# Altium project eeg-measurement-circuit_test-board.PrjPcb
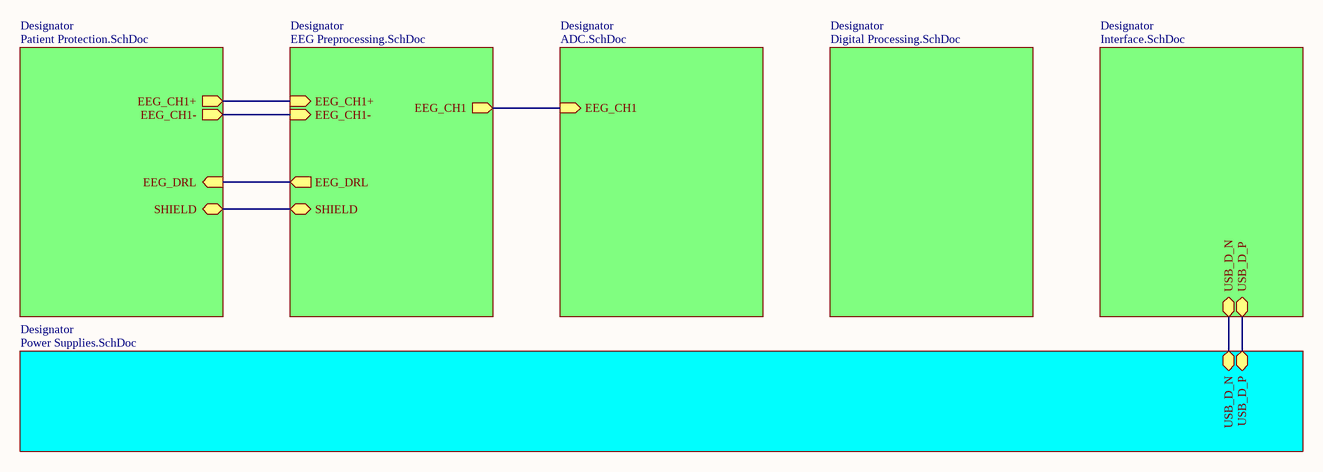
[diagram p0: Block Diagram.SchDoc]
6 sheets, 124 parts. Net scope: hierarchical (ports join the sheet entries above them; power ports are global).
Board file: PCB1.PcbDoc
Sheets:
  Block Diagram.SchDoc
    Designator = Power Supplies.SchDoc
    Designator = EEG Preprocessing.SchDoc
    Designator = ADC.SchDoc
    Designator = Interface.SchDoc
    Designator = Patient Protection.SchDoc

## Sheet Block Diagram.SchDoc: EEG Measurement Circuit
size A3; Date: 24/01/2025; DrawnBy: Giang Phan Truong; Revision: 1.1.0; SheetNumber: 1; SheetTotal: 7

### Sub-sheets
Designator = Power Supplies.SchDoc: USB_D_N (bidir), USB_D_P (bidir)
Designator = EEG Preprocessing.SchDoc: EEG_CH1+ (in), EEG_CH1- (in), EEG_CH1 (out), EEG_DRL (out), SHIELD (bidir)
Designator = ADC.SchDoc: EEG_CH1 (in)
Designator = Digital Processing.SchDoc (file not in this document): no entries
Designator = Interface.SchDoc: USB_D_P (bidir), USB_D_N (bidir)
Designator = Patient Protection.SchDoc: EEG_CH1+ (out), EEG_CH1- (out), EEG_DRL (in), SHIELD (bidir)

### Nets
SHIELD: sheet Designator/SHIELD, sheet Designator/SHIELD
USB_D_N: sheet Designator/USB_D_N, sheet Designator/USB_D_N
USB_D_P: sheet Designator/USB_D_P, sheet Designator/USB_D_P
NetC320_1: sheet Designator/EEG_DRL, sheet Designator/EEG_DRL
NetR200_2: sheet Designator/EEG_CH1-, sheet Designator/EEG_CH1-
NetR201_2: sheet Designator/EEG_CH1+, sheet Designator/EEG_CH1+
NetR322_1: sheet Designator/EEG_CH1, sheet Designator/EEG_CH1

### Notes on the sheet
- Project Name:
- Size
- Size:
- A3
- Revision:
- Drawn By:
- Date:
- File:
- Last Modified:
- Checked By:
- Sheet
- of

## Sheet Power Supplies.SchDoc: EEG Measurement Circuit
size A3; Date: 24/01/2025; DrawnBy: Giang Phan Truong; SheetNumber: 2; SheetTotal: 7
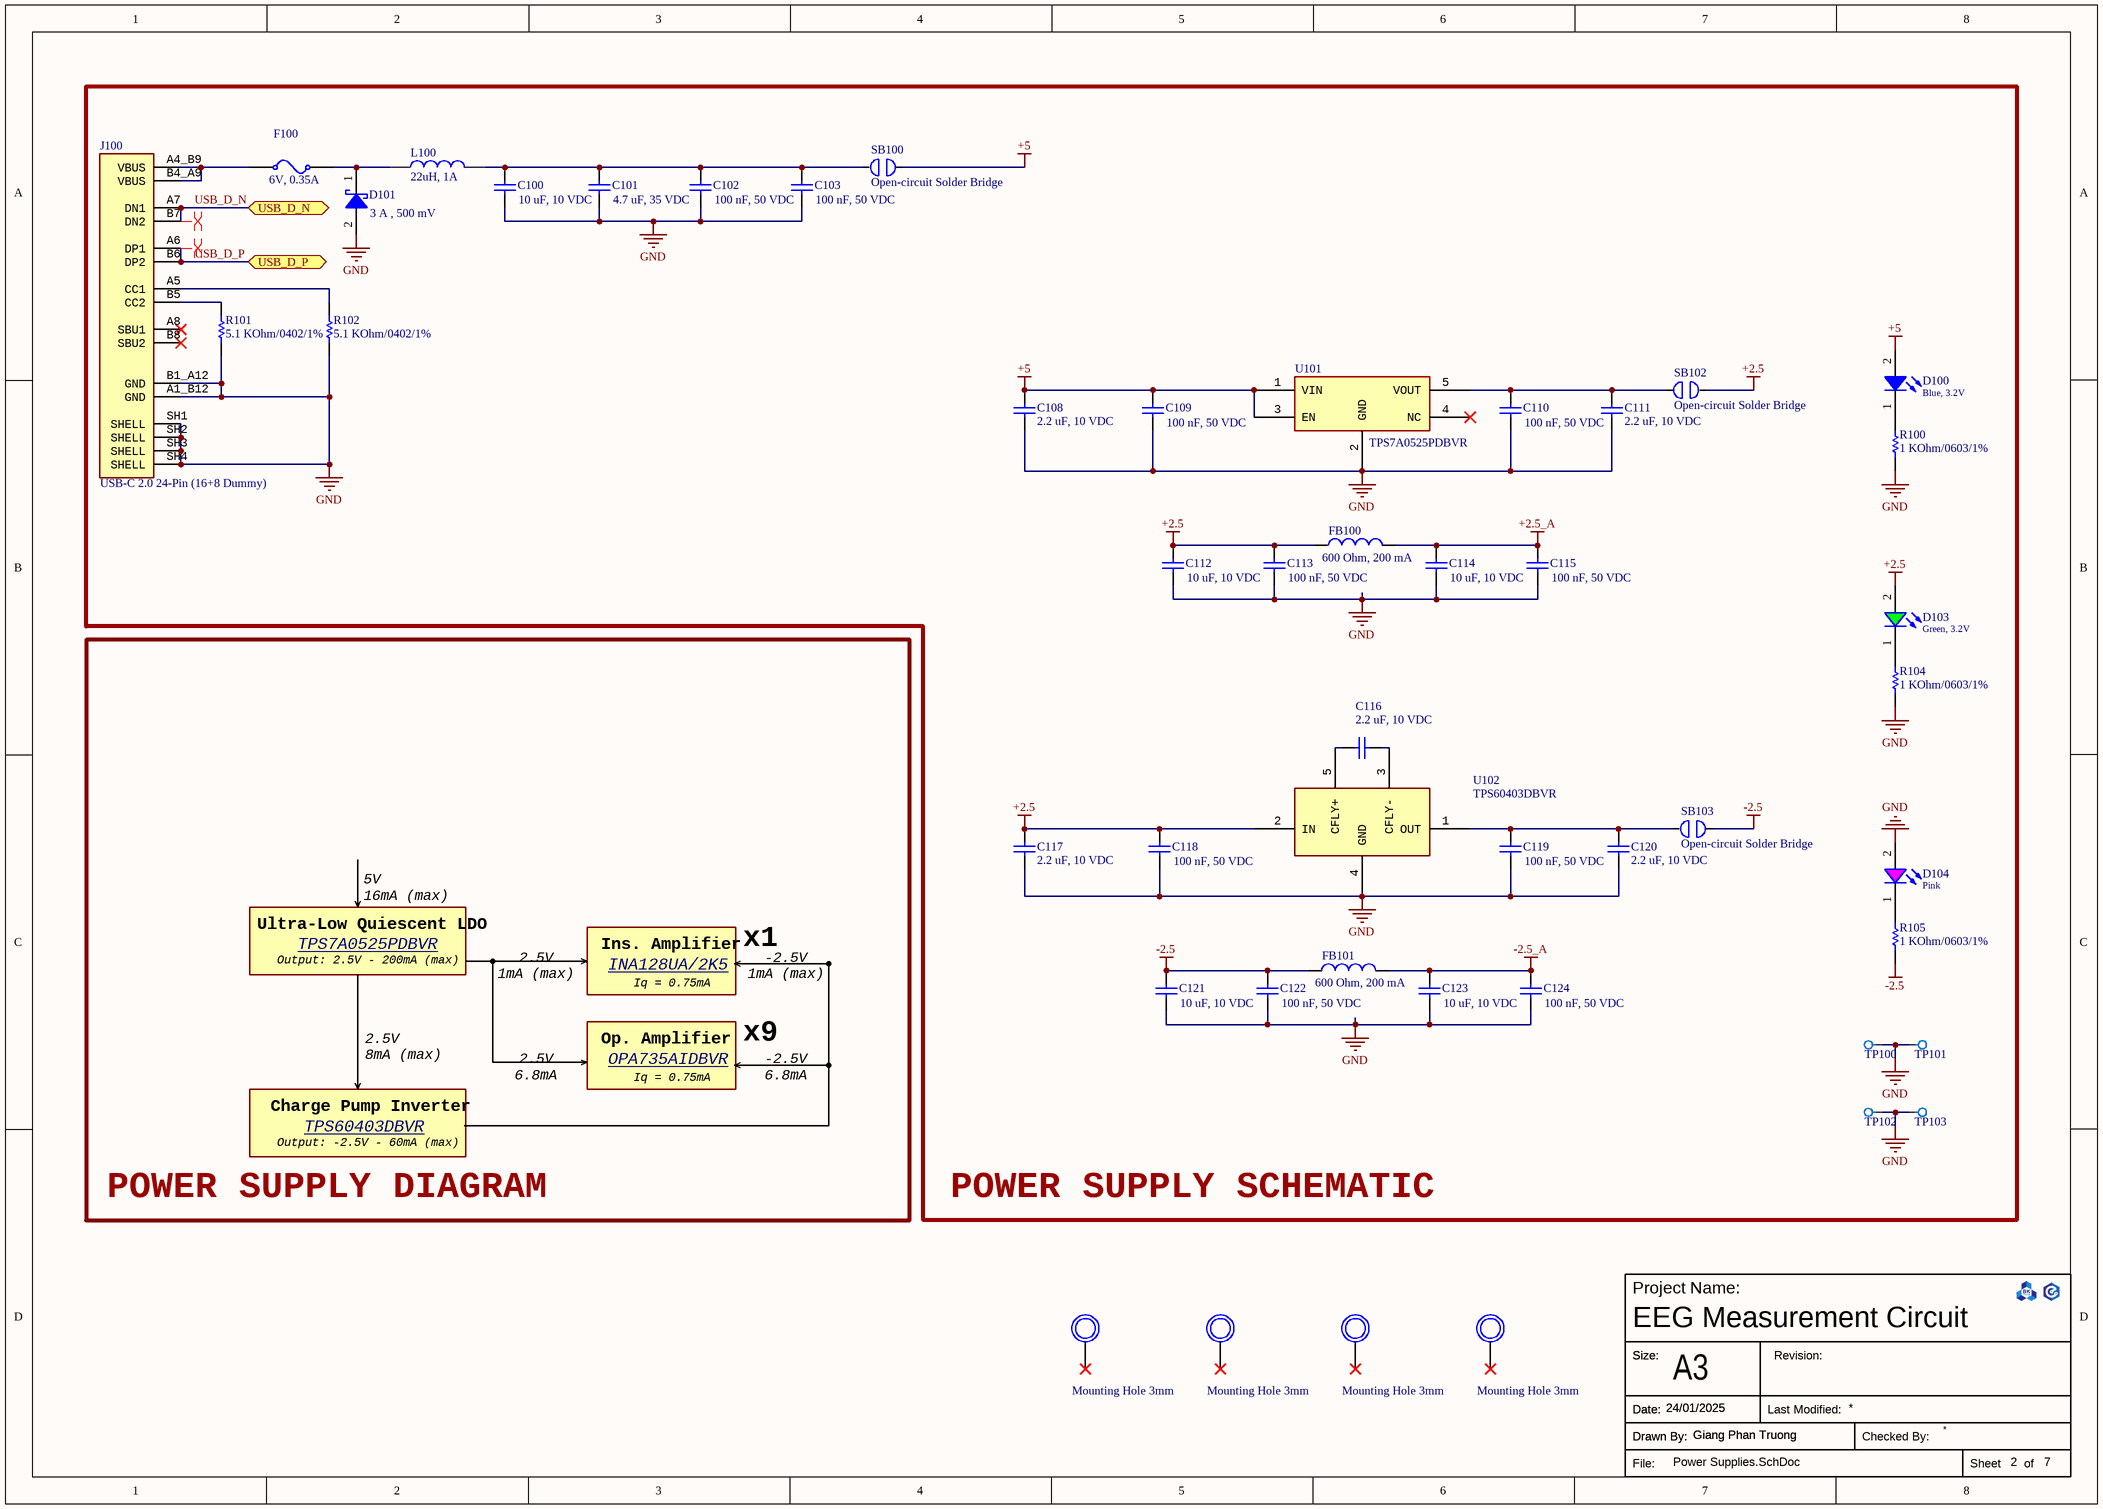
[diagram p1: Power Supplies.SchDoc]

### Parts
C100  10 uF, 10 VDC  [CAP_0603]
C101  4.7 uF, 35 VDC  [CAP_0603]
C102  100 nF, 50 VDC  [CAP_0603]
C103  100 nF, 50 VDC  [CAP_0603]
C108  2.2 uF, 10 VDC  [CAP_0603]
C109  100 nF, 50 VDC  [CAP_0603]
C110  100 nF, 50 VDC  [CAP_0603]
C111  2.2 uF, 10 VDC  [CAP_0603]
C112  10 uF, 10 VDC  [CAP_0603]
C113  100 nF, 50 VDC  [CAP_0603]
C114  10 uF, 10 VDC  [CAP_0603]
C115  100 nF, 50 VDC  [CAP_0603]
C116  2.2 uF, 10 VDC  [CAP_0603]
C117  2.2 uF, 10 VDC  [CAP_0603]
C118  100 nF, 50 VDC  [CAP_0603]
C119  100 nF, 50 VDC  [CAP_0603]
C120  2.2 uF, 10 VDC  [CAP_0603]
C121  10 uF, 10 VDC  [CAP_0603]
C122  100 nF, 50 VDC  [CAP_0603]
C123  10 uF, 10 VDC  [CAP_0603]
C124  100 nF, 50 VDC  [CAP_0603]
D100  Blue, 3.2V  [WL-SMCW_0603_H=0.7mm]
D101  3 A , 500 mV  [SMC (DO-214AB)]
D103  Green, 3.2V  [WL-SMCW_0603_H=0.7mm]
D104  Pink  [WL-SMCW_0603_H=0.7mm]
F100  6V, 0.35A  [Fuse_SMD_1206]
FB100  600 Ohm, 200 mA  [FER_0603]
FB101  600 Ohm, 200 mA  [FER_0603]
H100  Mounting Hole 3mm  [3mm with via]
H101  Mounting Hole 3mm  [3mm with via]
H102  Mounting Hole 3mm  [3mm with via]
H103  Mounting Hole 3mm  [3mm with via]
J100  value USB-C 2.0 24-Pin (16+8 Dummy)  [GCT_USB4105-GF-A]  (hidden comment: USB4105-GF-A)
L100  22uH, 1A  [Inductor_CDRH4D28]
R100  value 1 KOhm/0603/1%  [R0603]  (hidden comment: Resistor 1 KOhm 0603 1%)
R101  value 5.1 KOhm/0402/1%  [R0402]  (hidden comment: Resistor 5.1 KOhm 0402)
R102  value 5.1 KOhm/0402/1%  [R0402]  (hidden comment: Resistor 5.1 KOhm 0402)
R104  value 1 KOhm/0603/1%  [R0603]  (hidden comment: Resistor 1 KOhm 0603 1%)
R105  value 1 KOhm/0603/1%  [R0603]  (hidden comment: Resistor 1 KOhm 0603 1%)
SB100  Open-circuit Solder Bridge  [SolderBridgeOpen]
SB102  Open-circuit Solder Bridge  [SolderBridgeOpen]
SB103  Open-circuit Solder Bridge  [SolderBridgeOpen]
TP100  Testpoint_SMD  [TestPoint_Pad_3.0x3.0mm]  (value not drawn)
TP101  Testpoint_SMD  [TestPoint_Pad_3.0x3.0mm]  (value not drawn)
TP102  Testpoint_SMD  [TestPoint_Pad_3.0x3.0mm]  (value not drawn)
TP103  Testpoint_SMD  [TestPoint_Pad_3.0x3.0mm]  (value not drawn)
U101  TPS7A0525PDBVR  [DBV0005A_L]
U102  TPS60403DBVR  [SOT95P280X145-5N]

### Blocks framed on the sheet
POWER SUPPLY SCHEMATIC: C100-C103 C108-C124 D100 D101 D103 D104 F100 FB100 FB101 J100 L100 R100-R102 R104 R105 SB100 SB102 SB103 TP100-TP103 U101 U102

### Ports
USB_D_N (bidir, see Block Diagram[7B], Interface[5B]), USB_D_P (bidir, see Block Diagram[7B], Interface[5B])

### Nets
+2.5: C112.2 C113.2 C117.2 C118.2 D103.2(A) FB100.1 SB102.1 U102.2(IN)
+2.5_A: C114.2 C115.2 FB100.2
+5: C108.2 C109.2 D100.2(A) SB100.1 U101.1(VIN) U101.3(EN)
-2.5: C121.2 C122.2 FB101.1 R105.2 SB103.1
-2.5_A: C123.2 C124.2 FB101.2
GND: C100.1 C101.1 C102.1 C103.1 C108.1 C109.1 C110.1 C111.1 C112.1 C113.1 C114.1 C115.1 C117.1 C118.1 C119.1 C120.1 C121.1 C122.1 C123.1 C124.1 D101.2(A) D104.2(A) J100.A1_B12(GND) J100.B1_A12(GND) J100.SH1(SHELL) J100.SH2(SHELL) J100.SH3(SHELL) J100.SH4(SHELL) R100.2 R101.1 R102.1 R104.2 TP100.1 TP101.1 TP102.1 TP103.1 U101.2(GND) U102.4(GND)
USB_D_N: J100.A7(DN1) J100.B7(DN2) ; port USB_D_N
USB_D_P: J100.A6(DP1) J100.B6(DP2) ; port USB_D_P
NetC100_2: C100.2 C101.2 C102.2 C103.2 L100.2 SB100.2
NetC110_2: C110.2 C111.2 SB102.2 U101.5(VOUT)
NetC116_1: C116.1 U102.3(CFLY-)
NetC116_2: C116.2 U102.5(CFLY+)
NetC119_2: C119.2 C120.2 SB103.2 U102.1(OUT)
NetD100_1: D100.1(K) R100.1
NetD101_1: D101.1(K) F100.1 L100.1
NetD103_1: D103.1(K) R104.1
NetD104_1: D104.1(K) R105.1
NetF100_0: F100.0 J100.A4_B9(VBUS) J100.B4_A9(VBUS)
NetJ100_A5: J100.A5(CC1) R102.2
NetJ100_B5: J100.B5(CC2) R101.2

Not connected (* = marked no-connect by the designer): H100 0; H101 0; H102 0; H103 0; J100 A8(SBU1)* B8(SBU2)*; U101 4(NC)*

### Layout directives
differential pair: USB_D_N, USB_D_P

### Notes on the sheet
- 5V
  16mA (max)
- Ultra-Low Quiescent LDO
- Output: 2.5V - 200mA (max)
- TPS7A0525PDBVR <https://www.digikey.com/en/products/detail/texas-instruments/TPS7A0525PDBVR/9489224>
- 2.5V
  1mA (max)
- Ins. Amplifier
- INA128UA/2K5 <https://www.digikey.com/en/products/detail/texas-instruments/INA128UA-2K5/300998>
- Iq = 0.75mA
- x1
- -2.5V
  1mA (max)
- 2.5V
  8mA (max)
- Op. Amplifier
- x9
- Charge Pump Inverter
- 2.5V
  6.8mA (max)
- OPA735AIDBVR <https://www.digikey.com/en/products/detail/texas-instruments/OPA735AIDBVR/1572946>
- -2.5V
  6.8mA (max)
- Output: -2.5V - 60mA (max)
- TPS60403DBVR <https://www.digikey.com/en/products/detail/texas-instruments/TPS60403DBVR/1672064>
- POWER SUPPLY DIAGRAM
- Project Name:
- Size
- Size:
- A3
- Revision:
- Drawn By:
- Date:
- File:
- Last Modified:
- Checked By:
- Sheet
- of

### Library data of the parts
C100 C112 C114 C121 C123 = 0106031061010: CAP, size 0603, 10 uF, 10 VDC; Manufacture Name: Samsung Electro-Mechanics; Manufacture SN: CL10A106KP8NNWC; Capacitance: 10 uF; Tolerance: +/-10%; Voltage Rating DC: 10 VDC; ComponentLink2Description: Datasheet; ComponentLink2URL: https://www.mouser.vn/datasheet/2/585/MLCC-1837944.pdf; Operating Temperature: -55 to +125degC; Packaging: Tape and Reel; Mounting Technology: SMT; Size: 0603; Supplier 1 Name: Mouser; Supplier 1 SN: 187-CL10A106KP8NNWC; Supplier 1 URL: https://www.mouser.vn/ProductDetail/Samsung-Electro-Mechanics/CL10A106KP8NNWC?qs=xZ%2FP%252Ba9zWqZx8LSX23YqWA%3D%3D&utm_source=mouser-refine-download&utm_medium=file&utm_campaign=CL10A106KP8NNWC&utm_content=Samsung-Electro-Mechanics; Supplier 2 Name: Digi-Key; Supplier 2 SN: 1276-CL10A106KP8NNWCTR-ND; Supplier 2 URL: https://www.digikey.com/en/products/detail/samsung-electro-mechanics/cl10a106kp8nnwc/16572907; Supplier 3 Name: thegioiic; Supplier 3 SN: N/A; Supplier 3 URL: https://www.thegioiic.com/tu-gom-0603-10uf-25v; Value: 10 uF, 10 VDC; Buy: http://tme.vn/Product.aspx?id=1165#page=pro_info
C101 = 0106034751035: CAP, size 0603, 4.7 uF, 35 VDC; Manufacture Name: Samsung Electro-Mechanics; Manufacture SN: CL10A475KL8NRNC; Capacitance: 4.7 uF; Tolerance: +/-10%; Voltage Rating DC: 35 VDC; ComponentLink2Description: Datasheet; ComponentLink2URL: https://www.mouser.vn/datasheet/2/585/MLCC-1837944.pdf; Operating Temperature: -55 to +125degC; Packaging: Tape and Reel; Mounting Technology: SMT; Size: 0603; Supplier 1 Name: Mouser; Supplier 1 SN: 187-CL10A475KL8NRNC; Supplier 1 URL: https://www.mouser.vn/ProductDetail/Samsung-Electro-Mechanics/CL10A475KL8NRNC?qs=xZ%2FP%252Ba9zWqa0jfvJtp%252BUEg%3D%3D&utm_source=mouser-refine-download&utm_medium=file&utm_campaign=CL10A475KL8NRNC&utm_content=Samsung-Electro-Mechanics; Supplier 2 Name: Digi-Key; Supplier 2 SN: 1276-6794-2-ND; Supplier 2 URL: https://www.digikey.com/en/products/detail/samsung-electro-mechanics/cl10a475kl8nrnc/5961278; Supplier 3 Name: thegioiic; Supplier 3 SN: N/A; Supplier 3 URL: N/A; Value: 4.7 uF, 35 VDC; ComponentLink3Description: Buy; ComponentLink3URL: http://www.tme.vn/Product.aspx?id=1163#page=pro_info
C102 C103 C109 C110 C113 C115 C118 C119 C122 C124 = 0106031041050: CAP, size 0603, 100 nF, 50 VDC; Manufacture Name: TDK; Manufacture SN: CGA3E3X8R1H104K080AE; Capacitance: 100 nF; Tolerance: +/-10%; Voltage Rating DC: 50 VDC; ComponentLink2Description: Datasheet; ComponentLink2URL: https://product.tdk.com/system/files/dam/doc/product/capacitor/ceramic/mlcc/catalog/mlcc_automotive_soft_en.pdf?ref_disty=mouser; Operating Temperature: -55 to +125degC; Packaging: Tape and Reel; Mounting Technology: SMT; Size: 0603; Supplier 1 Name: Mouser; Supplier 1 SN: 810-CGA3E3X8R1H104KA; Supplier 1 URL: https://www.mouser.com/ProductDetail/TDK/CGA3E3X8R1H104K080AE?qs=nQSIdc08i%252Bd8g3IRRgU2bw%3D%3D&utm_source=mouser-refine-download&utm_medium=file&utm_campaign=CGA3E3X8R1H104K080AE&utm_content=TDK; Supplier 2 Name: Digi-Key; Supplier 2 SN: 445-173697-2-ND; Supplier 2 URL: https://www.digikey.com/en/products/detail/tdk-corporation/cga3e3x8r1h104k080ae/5809262; Supplier 3 Name: thegioiic; Supplier 3 SN: N/A; Supplier 3 URL: N/A; Value: 100 nF, 50 VDC
  C102 C103: ComponentLink3Description: Buy; ComponentLink3URL: http://www.tme.vn/Product.aspx?id=739#page=pro_info
C108 C111 C116 C117 C120 = 0106032251010: CAP, size 0603, 2.2 uF, 10 VDC; Manufacture Name: Samsung Electro-Mechanics; Manufacture SN: CL10A225KP8NNWC; Capacitance: 2.2 uF; Tolerance: +/-10%; Voltage Rating DC: 10 VDC; ComponentLink2Description: Datasheet; ComponentLink2URL: https://www.mouser.vn/datasheet/2/585/Samsung_MLCC_1837944-1929650.pdf; Operating Temperature: -55 to +125degC; Packaging: Tape and Reel; Mounting Technology: SMT; Size: 0603; Supplier 1 Name: Mouser; Supplier 1 SN: 187-CL10A225KP8NNWC; Supplier 1 URL: https://www.mouser.vn/ProductDetail/Samsung-Electro-Mechanics/CL10A225KP8NNWC?qs=f6khj2Jg0Fj5oIVDjMV6rg%3D%3D&utm_source=mouser-refine-download&utm_medium=file&utm_campaign=CL10A225KP8NNWC&utm_content=Samsung-Electro-Mechanics; Supplier 2 Name: Digi-Key; Supplier 2 SN: 1276-CL10A225KP8NNWCTR-ND; Supplier 2 URL: https://www.digikey.com/en/products/detail/samsung-electro-mechanics/cl10a225kp8nnwc/16572766; Supplier 3 Name: thegioiic; Supplier 3 SN: N/A; Supplier 3 URL: N/A; Value: 2.2 uF, 10 VDC
D100 = 160603BlueBlur: WL-SMCW SMT Mono-color Chip LED Blur, size 0603, Blue, 3.2V, 140deg; Color: Blue; Size: 0603; Type: Blur; ComponentLink1Description: Datasheet link; ComponentLink1URL: N/A; ComponentLink2Description: Supplier 1 URL; ComponentLink2URL: https://www.mouser.vn/ProductDetail/ams-OSRAM/LB-Q39E-L2OO-35-1?qs=74fRo9GAWsz%2FeNvglIOl1w%3D%3D; ComponentLink3Description: Supplier 2 URL; ComponentLink3URL: https://www.digikey.com/en/products/detail/ams-osram-usa-inc/LB-Q39E-N1OO-35-1/2176321; ComponentLink4Description: Supplier 3 URL; ComponentLink4URL: N/A; Supplier 1 Name: Mouser; Supplier 1 SN: 720-LBQ39EL2N2351; Supplier 1 URL: https://www.mouser.vn/ProductDetail/ams-OSRAM/LB-Q39E-L2OO-35-1?qs=74fRo9GAWsz%2FeNvglIOl1w%3D%3D; Supplier 2 Name: Digi-Key; Supplier 2 SN: 475-LBQ39E-N1OO-35-1TR-ND; Supplier 2 URL: https://www.digikey.com/en/products/detail/ams-osram-usa-inc/LB-Q39E-N1OO-35-1/2176321; Supplier 3 Name: ICDayRoi; Supplier 3 SN: N/A; Supplier 3 URL: N/A; Value: Blue, 3.2V; ComponentLink5Description: Buy; ComponentLink5URL: https://www.thegioiic.com/led-xanh-duong-0603-dan-smd-trong-suot-harvatek
D101 = SS34: Schottky Diodes & Rectifiers 3.0 Amp 40 Volt; Manufacturer: Vishay Semiconductors; Manufacturer Part Number: SS34-E3/57T; Forward Current: 3 A; Forward Voltage: 500 mV; Max Surge Current: 100 A; Peak Reverse Voltage: 40 V; Reverse Current: 500 uA; Type: Schottky; Supplier 1 URL: https://www.mouser.vn/ProductDetail/Vishay-General-Semiconductor/SS34-E3-57T?qs=x2jpVgRnAtMC3f38kYWnRw%3D%3D; Supplier 2 URL: https://www.digikey.com/en/products/detail/vishay-general-semiconductor-diodes-division/ss34-e3-57t/1091554; Supplier 3 URL: https://www.thegioiic.com/ss34-sma-diode-schottky-3a; Value: 3 A , 500 mV; Maximum Diode Capacitance: N/A; Power Dissipation: N/A; Recovery Time: N/A; Supplier 1: Mouser; Supplier 1 Part Number: 625-SS34-E3; Supplier 2: Digi-Key; Supplier 2 Part Number: SS34-E3/57TGITR-ND; Supplier 3: thegioiic; Supplier 3 Part Number: SS34; Mount: SMD/SMT; Operating Temperature Max: + 85 C; Operating Temperature Min: - 40 C; Package / Case: SMC (DO-214AB); Packaging: Tape and Reel; ComponentLink1Description: Datasheet; ComponentLink1URL: https://www.vishay.com/doc?88751; LCSC Part #: C3008890
D103 = 160603GreenBlur: WL-SMCW SMT Mono-color Chip LED Blur, size 0603, Green, 3.2V, 140deg; Color: Green; Size: 0603; Type: Blur; ComponentLink1Description: Datasheet link; ComponentLink1URL: N/A; ComponentLink2Description: Supplier 1 URL; ComponentLink2URL: https://www.mouser.vn/ProductDetail/ROHM-Semiconductor/SMLD12EN1WT86?qs=qSfuJ%252Bfl%2Fd4fR%252B9yZydIwg%3D%3D; ComponentLink3Description: Supplier 2 URL; ComponentLink3URL: https://www.digikey.com/en/products/detail/rohm-semiconductor/SML-D12M8WT86/1641797; ComponentLink4Description: Supplier 3 URL; ComponentLink4URL: N/A; Supplier 1 Name: Mouser; Supplier 1 SN: 755-SMLD12EN1WT86; Supplier 1 URL: https://www.mouser.vn/ProductDetail/ROHM-Semiconductor/SMLD12EN1WT86?qs=qSfuJ%252Bfl%2Fd4fR%252B9yZydIwg%3D%3D; Supplier 2 Name: Digi-Key; Supplier 2 SN: 511-1578-2-ND; Supplier 2 URL: https://www.digikey.com/en/products/detail/rohm-semiconductor/SML-D12M8WT86/1641797; Supplier 3 Name: ICDayRoi; Supplier 3 SN: N/A; Supplier 3 URL: N/A; Value: Green, 3.2V; ComponentLink5Description: Buy; ComponentLink5URL: https://www.thegioiic.com/led-xanh-la-0603-dan-smd-trong-suot
D104 = 160603PinkBlur: WL-SMCW SMT Mono-color Chip LED Blur, size 0603, Pink; Color: Pink; Size: 0603; Type: Blur; ComponentLink1Description: Datasheet link; ComponentLink1URL: N/A; ComponentLink2Description: Supplier 1 URL; ComponentLink2URL: N/A; ComponentLink3Description: Supplier 2 URL; ComponentLink3URL: https://www.digikey.com/en/products/detail/rohm-semiconductor/SMLD12HBC7W1/3587026; ComponentLink4Description: Supplier 3 URL; ComponentLink4URL: N/A; Supplier 1 Name: Mouser; Supplier 1 SN: N/A; Supplier 1 URL: N/A; Supplier 2 Name: Digi-Key; Supplier 2 SN: 846-1108-2-ND; Supplier 2 URL: https://www.digikey.com/en/products/detail/rohm-semiconductor/SMLD12HBC7W1/3587026; Supplier 3 Name: ICDayRoi; Supplier 3 SN: N/A; Supplier 3 URL: N/A; Value: Pink; ComponentLink5Description: Buy; ComponentLink5URL: https://www.thegioiic.com/led-hong-0603-dan-smd-trong-suot
F100 = 061206035006: Resettable Fuse, Size 1206, 6V, 0.35A; Manufacturer: Bourns; Threshold Current: 100A; Trip Current: 0.75A; Threshold Voltage: 6V; Hold Current: 0.35A; Size: 1206; Mounting Technology: SMT/SMD; ComponentLink1Description: Datasheet link; ComponentLink1URL: https://www.bourns.com/docs/Product-Datasheets/mfnsmf.pdf; ComponentLink2Description: Supplier 1 URL; ComponentLink2URL: https://www.mouser.vn/ProductDetail/Bourns/MF-NSMF035-2?qs=3eVyCPG4fwnHDrvs%2FGppSw%3D%3D; ComponentLink3Description: Supplier 2 URL; ComponentLink3URL: https://www.digikey.com/en/products/detail/bourns-inc/MF-NSMF035-2/1232784?s=N4IgTCBcDaILIDEC0A5AyogDAZgKxIgF0BfIA; ComponentLink4Description: Supplier 3 URL; ComponentLink4URL: https://www.thegioiic.com/mf-nsmf035-2-cau-chi-tu-phuc-hoi-1206-6v-0-35a; Supplier 1 Name: Mouser; Supplier 1 SN: 652-MF-NSMF035-2; Supplier 1 URL: https://www.mouser.vn/ProductDetail/Bourns/MF-NSMF035-2?qs=3eVyCPG4fwnHDrvs%2FGppSw%3D%3D; Supplier 2 Name: Digi-Key; Supplier 2 SN: MF-NSMF035-2TR-ND; Supplier 2 URL: https://www.mouser.vn/ProductDetail/Bourns/MF-NSMF035-2?qs=3eVyCPG4fwnHDrvs%2FGppSw%3D%3D; Supplier 3 Name: thegioiic; Supplier 3 SN: MF-NSMF035-2; Supplier 3 URL: https://www.thegioiic.com/mf-nsmf035-2-cau-chi-tu-phuc-hoi-1206-6v-0-35a; Value: 6V, 0.35A
FB100 FB101 = 03060360120125: Ferrite, 0603, 600 Ohms, 200 mA; Manufacture Name: Wurth Elektronik; Manufacture SN: 74279265; Tolerance: +/-25%; Maximum DC Current: 200 mA; Maximum DC Resistance: 450 mOhms; Test Frequency: 100 MHz; ComponentLink2Description: Datasheet; ComponentLink2URL: https://www.we-online.com/catalog/datasheet/74279265.pdf; Mounting Technology: SMT; Operating Temperature: -55 to +125degC; Packaging: Tape and Reel; Size: 0603; Supplier 1 SN: 710-74279265; Supplier 1 URL: https://www.mouser.com/ProductDetail/Wurth-Elektronik/74279265?qs=sGAEpiMZZMt1hubY80%2Fs8M60rIzA20dglmJIomIYNv0%3D&utm_source=mouser-refine-download&utm_medium=file&utm_campaign=74279265&utm_content=Wurth-Elektronik; Supplier 2 SN: N/A; Supplier 2 URL: N/A; Supplier 3 SN: N/A; Supplier 3 URL: N/A; Supplier 1 Name: Mouser; Supplier 2 Name: Digi-Key; Supplier 3 Name: thegioiic; Impedance: 600 Ohms; Value: 600 Ohm, 200 mA; Buy: *
J100 = USB4105-GF-A: USB-C (USB TYPE-C) USB 2.0 Receptacle Connector 24 (16+8 Dummy) Position Surface Mount, Right Angle; Through Hole; MF: {'manufacturer': u'GCT'}; Package: None; Price: None; MP: USB4105-GF-A; Availability: Unavailable; ComponentLink1Description: Buy; ComponentLink1URL: https://www.thegioiic.com/cong-usb-cai-3-1-type-c-16-chan-thang-dan-smd
L100 = IND_22uH_4D28: 22uH 20% 1A SMD Power Inductor 4.8x4.8x2.8 mm; Supply Name: tme; Supply Part Number: 22uH 20% 1A SMD Power Inductor 4.8x4.8x2.8 mm; Supply URL: http://www.tme.vn/Product.aspx?id=1639#page=pro_info; Value: 22uH, 1A; ComponentLink1Description: Buy; ComponentLink1URL: http://tme.vn/Product.aspx?id=1639#page=pro_info
R100 R104 R105 = Resistor 1 KOhm 0603 1%: Code 102, 1/10W; ComponentLink1Description: Buy; ComponentLink1URL: https://www.thegioiic.com/dien-tro-1-kohm-0603-1
R101 R102 = Resistor 5.1 KOhm 0402: RC0402FR-135K1L; ComponentLink1Description: Buy; ComponentLink1URL: https://www.digikey.com/en/products/detail/yageo/RC0402FR-135K1L/14286364
U101 = TPS7A0525PDBVR: Linear Voltage Regulator IC Positive Fixed 1 Output 200mA SOT-23-5; Mfr_Name: Texas Instruments; TYPE: TYPE; RefDes: RefDes; ComponentLink1Description: Buy; ComponentLink1URL: https://www.digikey.com/en/products/detail/texas-instruments/TPS7A0525PDBVR/9489224; Value: TPS7A0525PDBVR
U102 = TPS60403DBVR: 60mA Charge Pump Voltage Inverter with Fixed 250kHz Operation; MF: Texas Instruments; Mouser-Purchase-URL: https://snapeda.com/shop?store=Mouser&id=1101412; Availability: Unavailable; Price: None; Package: SOT-23-5 Texas Instruments; DigiKey-Purchase-URL: https://snapeda.com/shop?store=DigiKey&id=1101412; MP: TPS60403DBVR; SnapEDA_Link: https://www.snapeda.com/parts/TPS60403DBVR/Texas%20Instruments/view-part/1101412/?ref=snap; Arrow_Electronics-Purchase-URL: https://snapeda.com/shop?store=Arrow+Electronics&id=1101412; Texas_Instruments-Purchase-URL: https://snapeda.com/shop?store=Texas+Instruments&id=1101412; ComponentLink1Description: Buy; ComponentLink1URL: https://www.digikey.com/en/products/detail/texas-instruments/TPS60403DBVR/1672064; Value: TPS60403DBVR
TP100-TP103 = Testpoint_SMD: Datasheet: *; Supply Name: *; Supply Part Number: *; Supply URL: *

## Sheet EEG Preprocessing.SchDoc: EEG Measurement Circuit
size A2; Date: 24/01/2025; DrawnBy: Giang Phan Truong; SheetNumber: 4; SheetTotal: 7; SPICEModelCacheZASXATAV: <root> / <DocumentId>ZASXATAV</DocumentId> / </root>
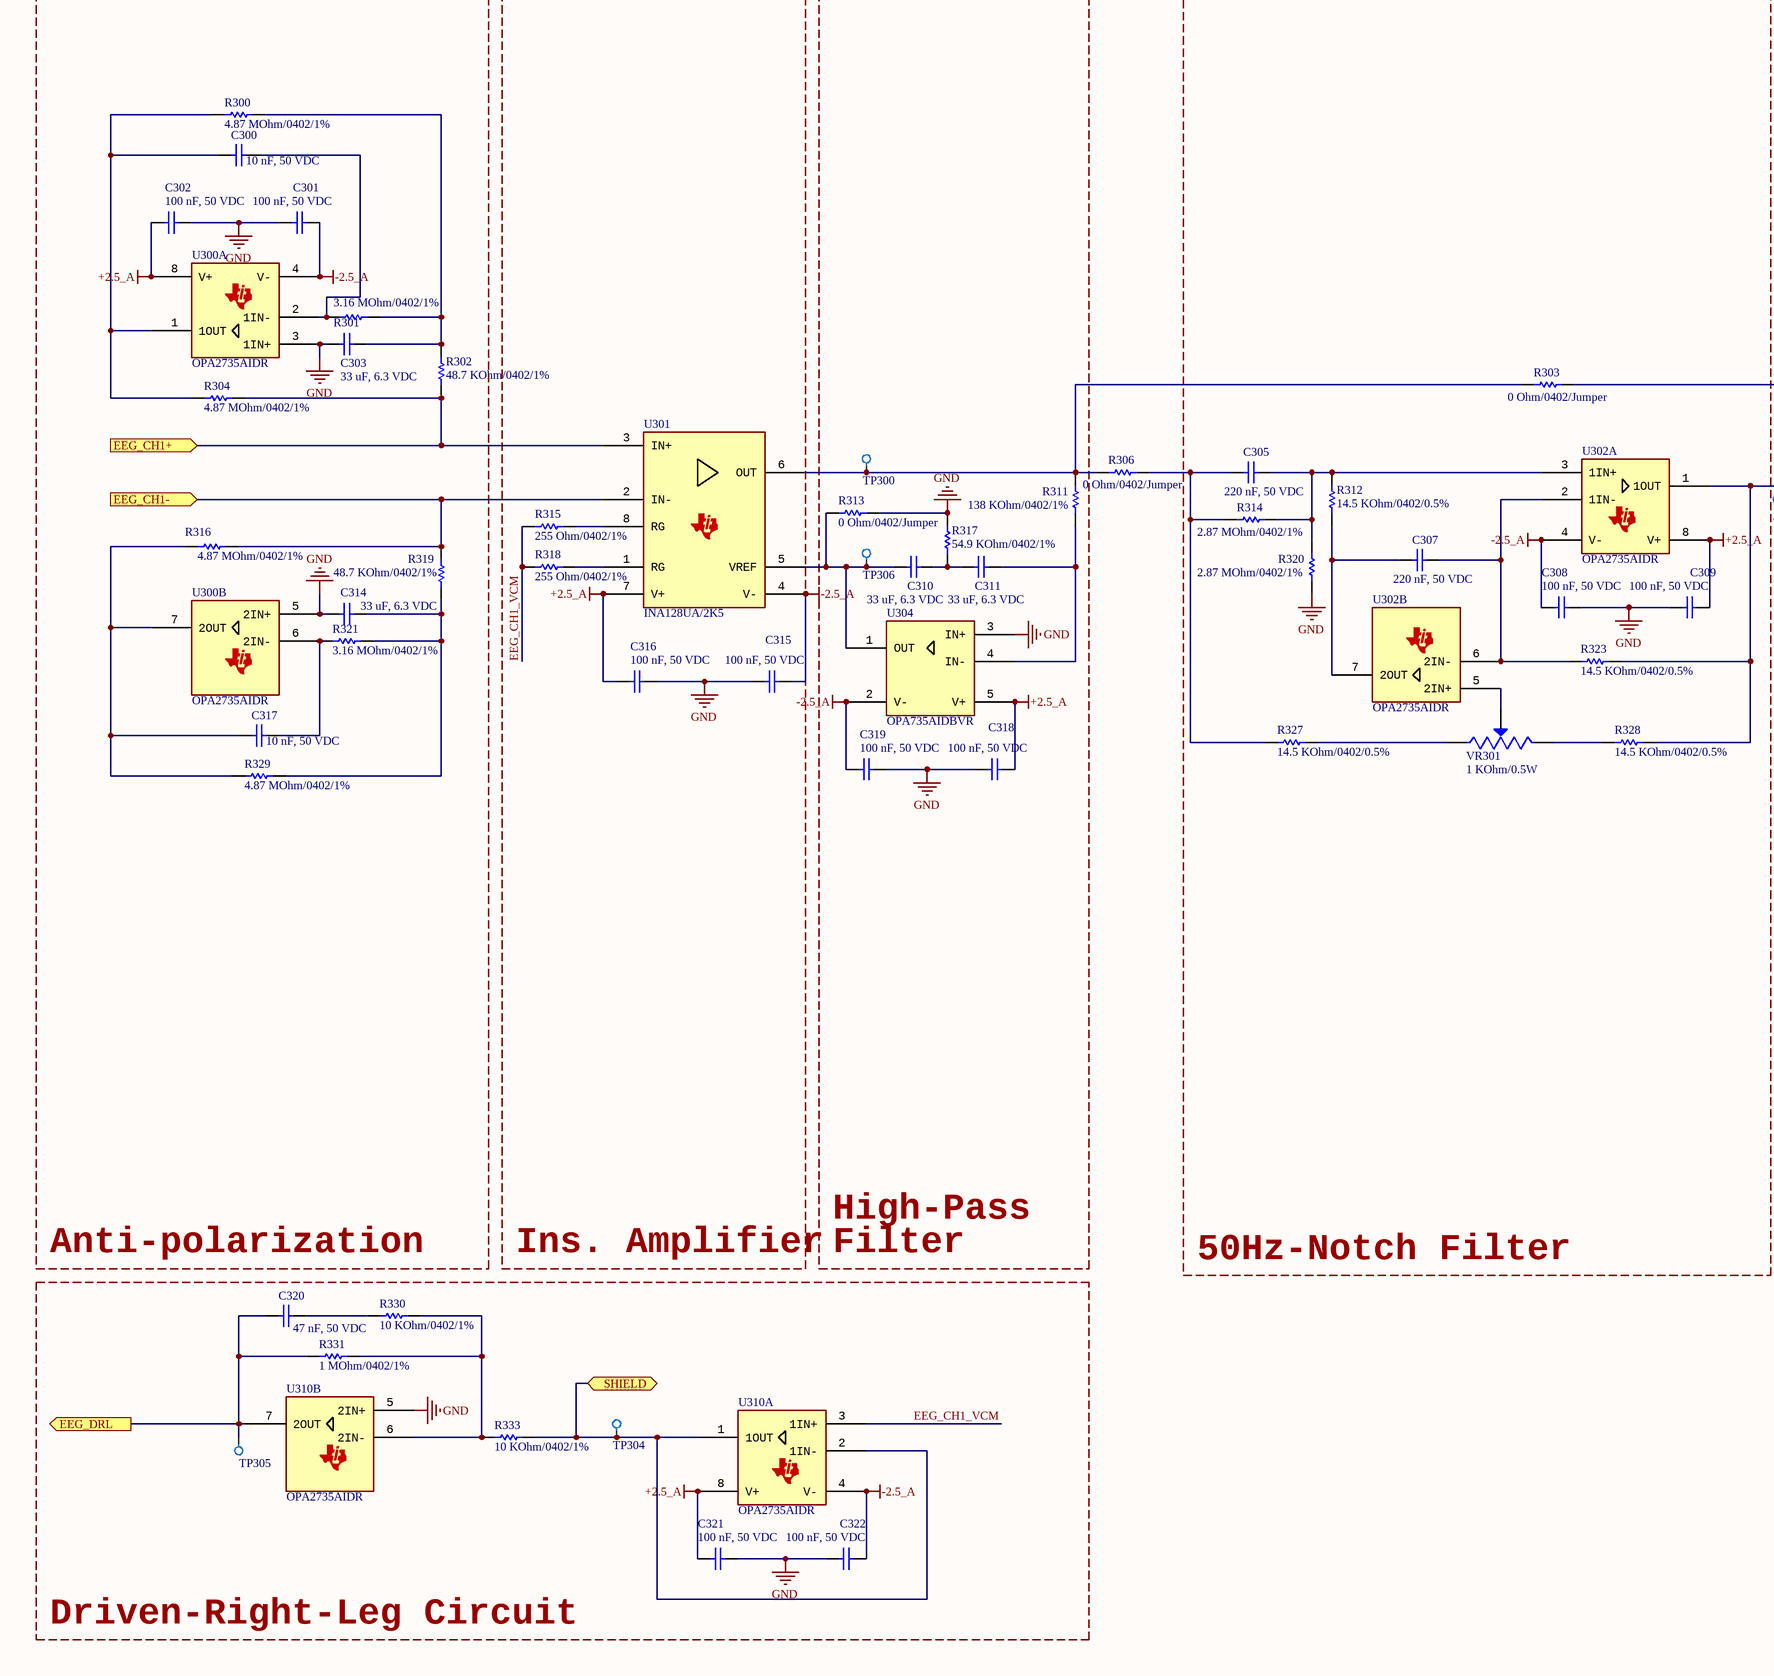
[diagram p2: EEG Preprocessing.SchDoc, left]
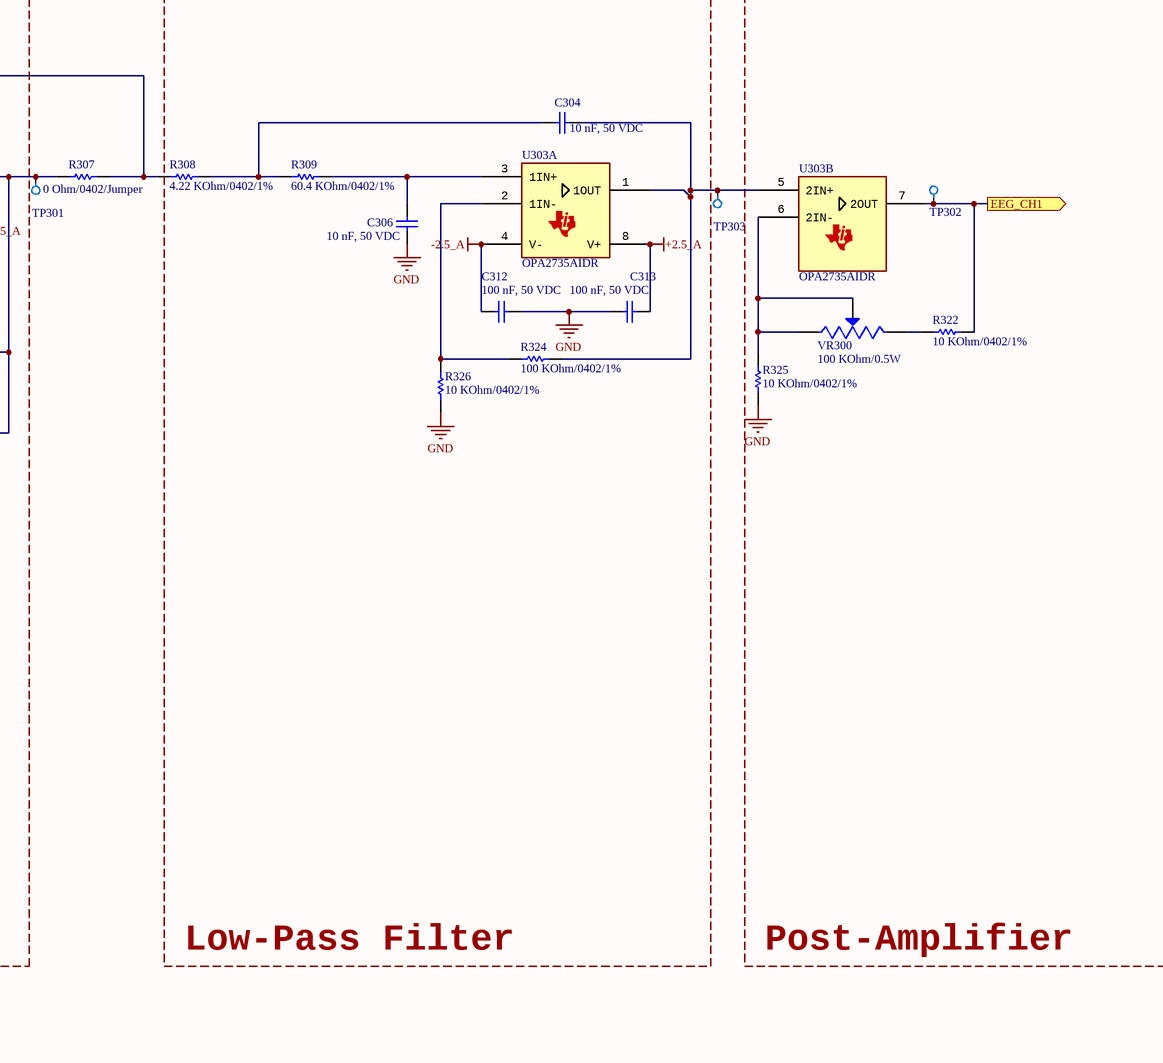
[diagram p3: EEG Preprocessing.SchDoc, right]

### Parts
C300  10 nF, 50 VDC  [CAP_0603]
C301  100 nF, 50 VDC  [CAP_0603]
C302  100 nF, 50 VDC  [CAP_0603]
C303  33 uF, 6.3 VDC  [CAP_0805]
C304  10 nF, 50 VDC  [CAP_0603]
C305  220 nF, 50 VDC  [CAP_0603]
C306  10 nF, 50 VDC  [CAP_0603]
C307  220 nF, 50 VDC  [CAP_0603]
C308  100 nF, 50 VDC  [CAP_0603]
C309  100 nF, 50 VDC  [CAP_0603]
C310  33 uF, 6.3 VDC  [CAP_0805]
C311  33 uF, 6.3 VDC  [CAP_0805]
C312  100 nF, 50 VDC  [CAP_0603]
C313  100 nF, 50 VDC  [CAP_0603]
C314  33 uF, 6.3 VDC  [CAP_0805]
C315  100 nF, 50 VDC  [CAP_0603]
C316  100 nF, 50 VDC  [CAP_0603]
C317  10 nF, 50 VDC  [CAP_0603]
C318  100 nF, 50 VDC  [CAP_0603]
C319  100 nF, 50 VDC  [CAP_0603]
C320  47 nF, 50 VDC  [CAP_0603]
C321  100 nF, 50 VDC  [CAP_0603]
C322  100 nF, 50 VDC  [CAP_0603]
R300  value 4.87 MOhm/0402/1%  [R0402]  (hidden comment: Resistor 4.87 MOhm 0402 1%)
R301  value 3.16 MOhm/0402/1%  [R0402]  (hidden comment: Resistor 3.16 MOhm 0402 1%)
R302  value 48.7 KOhm/0402/1%  [R0402]  (hidden comment: Resistor 48.7 KOhm 0402 1%)
R303  value 0 Ohm/0402/Jumper  [R0402]  (hidden comment: Resistor 0 Ohm 0402)
R304  value 4.87 MOhm/0402/1%  [R0402]  (hidden comment: Resistor 4.87 MOhm 0402 1%)
R306  value 0 Ohm/0402/Jumper  [R0402]  (hidden comment: Resistor 0 Ohm 0402)
R307  value 0 Ohm/0402/Jumper  [R0402]  (hidden comment: Resistor 0 Ohm 0402)
R308  value 4.22 KOhm/0402/1%  [R0402]  (hidden comment: Resistor 4.22 KOhm 0402 1%)
R309  value 60.4 KOhm/0402/1%  [R0402]  (hidden comment: Resistor 60.4 KOhm 0402 1%)
R311  value 138 KOhm/0402/1%  [R0402]  (hidden comment: Resistor 138 KOhm 0402 1%)
R312  value 14.5 KOhm/0402/0.5%  [R0402]  (hidden comment: Resistor 14.5 KOhm 0402 0.5%)
R313  value 0 Ohm/0402/Jumper  [R0402]  (hidden comment: Resistor 0 Ohm 0402)
R314  value 2.87 MOhm/0402/1%  [R0402]  (hidden comment: Resistor 2.87 MOhm 0402 1%)
R315  value 255 Ohm/0402/1%  [R0402]  (hidden comment: Resistor 255 Ohm 0402 1%)
R316  value 4.87 MOhm/0402/1%  [R0402]  (hidden comment: Resistor 4.87 MOhm 0402 1%)
R317  value 54.9 KOhm/0402/1%  [R0402]  (hidden comment: Resistor 54.9 KOhm 0402 1%)
R318  value 255 Ohm/0402/1%  [R0402]  (hidden comment: Resistor 255 Ohm 0402 1%)
R319  value 48.7 KOhm/0402/1%  [R0402]  (hidden comment: Resistor 48.7 KOhm 0402 1%)
R320  value 2.87 MOhm/0402/1%  [R0402]  (hidden comment: Resistor 2.87 MOhm 0402 1%)
R321  value 3.16 MOhm/0402/1%  [R0402]  (hidden comment: Resistor 3.16 MOhm 0402 1%)
R322  value 10 KOhm/0402/1%  [R0402]  (hidden comment: Resistor 10 KOhm 0402 1%)
R323  value 14.5 KOhm/0402/0.5%  [R0402]  (hidden comment: Resistor 14.5 KOhm 0402 0.5%)
R324  value 100 KOhm/0402/1%  [R0402]  (hidden comment: Resistor 100 KOhm 0402 1%)
R325  value 10 KOhm/0402/1%  [R0402]  (hidden comment: Resistor 10 KOhm 0402 1%)
R326  value 10 KOhm/0402/1%  [R0402]  (hidden comment: Resistor 10 KOhm 0402 1%)
R327  value 14.5 KOhm/0402/0.5%  [R0402]  (hidden comment: Resistor 14.5 KOhm 0402 0.5%)
R328  value 14.5 KOhm/0402/0.5%  [R0402]  (hidden comment: Resistor 14.5 KOhm 0402 0.5%)
R329  value 4.87 MOhm/0402/1%  [R0402]  (hidden comment: Resistor 4.87 MOhm 0402 1%)
R330  value 10 KOhm/0402/1%  [R0402]  (hidden comment: Resistor 10 KOhm 0402 1%)
R331  value 1 MOhm/0402/1%  [R0402]  (hidden comment: Resistor 1 MOhm 0402 1%_1)
R333  value 10 KOhm/0402/1%  [R0402]  (hidden comment: Resistor 10 KOhm 0402 1%)
TP300  Testpoint_TH  [TestPoint_THTPad_D1.5mm_Drill0.7mm]  (value not drawn)
TP301  Testpoint_TH  [TestPoint_THTPad_D1.5mm_Drill0.7mm]  (value not drawn)
TP302  Testpoint_TH  [TestPoint_THTPad_D1.5mm_Drill0.7mm]  (value not drawn)
TP303  Testpoint_TH  [TestPoint_THTPad_D1.5mm_Drill0.7mm]  (value not drawn)
TP304  Testpoint_TH  [TestPoint_THTPad_D1.5mm_Drill0.7mm]  (value not drawn)
TP305  Testpoint_TH  [TestPoint_THTPad_D1.5mm_Drill0.7mm]  (value not drawn)
TP306  Testpoint_TH  [TestPoint_THTPad_D1.5mm_Drill0.7mm]  (value not drawn)
U300  OPA2735AIDR  [SOIC-8]  (parts A,B of 2)
U301  INA128UA/2K5  [SOIC-8]
U302  OPA2735AIDR  [SOIC-8]  (parts A,B of 2)
U303  OPA2735AIDR  [SOIC-8]  (parts A,B of 2)
U304  OPA735AIDBVR  [SOT-23]
U310  OPA2735AIDR  [SOIC-8]  (parts A,B of 2)
VR300  value 100 KOhm/0.5W  [TRIM_3296W]  (hidden comment: 3296W-104)
VR301  value 1 KOhm/0.5W  [TRIM_3296W]  (hidden comment: 3296W-102)

### Blocks framed on the sheet
Anti-polarization: C300-C303 C314 C317 R300-R302 R304 R316 R319 R321 R329 U300
Ins. Amplifier: C315 C316 R315 R318 U301
50Hz-Notch Filter: C305 C307-C309 R303 R312 R314 R320 R323 R327 R328 U302 VR301
Low-Pass Filter: C304 C306 C312 C313 R308 R309 R324 R326 U303
Post-Amplifier: R322 R325 TP302 U303 VR300
Driven-Right-Leg Circuit: C320-C322 R330 R331 R333 TP304 TP305 U310

### Ports
EEG_CH1 (out, see Block Diagram[4B], ADC[1B]), EEG_CH1+ (in, see Block Diagram[3B], Patient Protection[5B]), EEG_CH1- (in, see Block Diagram[3B], Patient Protection[5B]), EEG_DRL (out, see Block Diagram[3B], Patient Protection[5C]), SHIELD (bidir, see Block Diagram[3B], Patient Protection[4C])

### Nets
+2.5_A: C302.2 C309.1 C313.1 C316.2 C318.1 C321.2 U300.8(V+) U301.7(V+) U302.8(V+) U303.8(V+) U304.5(V+) U310.8(V+)
-2.5_A: C301.1 C308.2 C312.2 C315.1 C319.2 C322.1 U300.4(V-) U301.4(V-) U302.4(V-) U303.4(V-) U304.2(V-) U310.4(V-)
GND: C301.2 C302.1 C303.1 C306.1 C308.1 C309.2 C312.1 C313.2 C314.1 C315.2 C316.1 C318.2 C319.1 C321.1 C322.2 R313.1 R317.1 R320.1 R325.1 R326.1 U300.3(1IN+) U300.5(2IN+) U304.3(IN+) U310.5(2IN+)
EEG_CH1_VCM: R315.2 R318.2 U310.3(1IN+)  [project net EEG_CH1_VCM_4]
SHIELD: R333.2 TP304.1 U310.1(1OUT) U310.2(1IN-) ; port SHIELD
NetC300_1: C300.1 R300.1 R304.1 U300.1(1OUT)
NetC300_2: C300.2 R301.1 U300.2(1IN-)
NetC303_2: C303.2 R300.2 R301.2 R302.2
NetC304_1: C304.1 R308.2 R309.1
NetC304_2: C304.2 R324.2 TP303.1 U303.1(1OUT) U303.5(2IN+)
NetC305_1: C305.1 R306.2 R314.1 R327.2
NetC305_2: C305.2 R312.2 R314.2 R320.2 U302.3(1IN+)
NetC306_2: C306.2 R309.2 U303.3(1IN+)
NetC307_1: C307.1 R312.1 U302.7(2OUT)
NetC307_2: C307.2 R323.2 U302.2(1IN-) U302.6(2IN-)
NetC310_1: C310.1 R313.2 TP306.1 U301.5(VREF) U304.1(OUT)
NetC310_2: C310.2 C311.1 R317.2
NetC311_2: C311.2 R311.1 U304.4(IN-)
NetC314_2: C314.2 R319.1 R321.2 R329.2
NetC317_1: C317.1 R316.1 R329.1 U300.7(2OUT)
NetC317_2: C317.2 R321.1 U300.6(2IN-)
NetC320_1: C320.1 R331.1 TP305.1 U310.7(2OUT) ; port EEG_DRL
NetC320_2: C320.2 R330.1
NetR200_2: R316.2 R319.2 U301.2(IN-) ; port EEG_CH1-
NetR201_2: R302.1 R304.2 U301.3(IN+) ; port EEG_CH1+
NetR303_1: R303.1 R306.1 R311.2 TP300.1 U301.6(OUT)
NetR303_2: R303.2 R307.2 R308.1
NetR307_1: R307.1 R323.1 R328.1 TP301.1 U302.1(1OUT)
NetR315_1: R315.1 U301.8(RG)
NetR318_1: R318.1 U301.1(RG)
NetR322_1: R322.1 TP302.1 U303.7(2OUT) ; port EEG_CH1
NetR322_2: R322.2 VR300.3(CW)
NetR324_1: R324.1 R326.2 U303.2(1IN-)
NetR325_2: R325.2 U303.6(2IN-) VR300.1(CCW) VR300.2(WIPER)
NetR327_1: R327.1 VR301.1(CCW)
NetR328_2: R328.2 VR301.3(CW)
NetR330_2: R330.2 R331.2 R333.1 U310.6(2IN-)
NetU302_5: U302.5(2IN+) VR301.2(WIPER)

### Notes on the sheet
- High-Pass
- Filter
- Project Name:
- Date:
- Size
- Size:
- A2
- Last Modified:
- Revision:
- Drawn By:
- File:
- Checked By:
- Sheet
- of

### Library data of the parts
C300 C304 C306 C317 = 0106031030550: CAP, size 0603, 10 nF, 50 VDC; Manufacture Name: TDK; Manufacture SN: CGA3E2C0G1H103J080AE; Capacitance: 10 nF; Tolerance: +/-5%; Voltage Rating DC: 50 VDC; ComponentLink2Description: Datasheet; ComponentLink2URL: https://product.tdk.com/system/files/dam/doc/product/capacitor/ceramic/mlcc/catalog/mlcc_automotive_soft_en.pdf?ref_disty=mouser; Operating Temperature: -55 to +125degC; Packaging: Tape and Reel; Mounting Technology: SMT; Size: 0603; Supplier 1 Name: Mouser; Supplier 1 SN: 810-CGA3E2C0G1H103J8; Supplier 1 URL: https://www.mouser.com/ProductDetail/TDK/CGA3E2C0G1H103J080AE?qs=P1JMDcb91o6ZkMITrWTUZQ%3D%3D&utm_source=mouser-refine-download&utm_medium=file&utm_campaign=CGA3E2C0G1H103J080AE&utm_content=TDK; Supplier 2 Name: Digi-Key; Supplier 2 SN: 445-CGA3E2C0G1H103J080AETR-ND; Supplier 2 URL: https://www.digikey.com/en/products/detail/tdk-corporation/cga3e2c0g1h103j080ae/11697946; Supplier 3 Name: thegioiic; Supplier 3 SN: N/A; Supplier 3 URL: N/A; Value: 10 nF, 50 VDC
C301 C302 C308 C309 C312 C313 C315 C316 C318 C319 C321 C322 = 0106031041050: as C102 on sheet Power Supplies; ComponentLink2Description: Datasheet; ComponentLink2URL: https://product.tdk.com/system/files/dam/doc/product/capacitor/ceramic/mlcc/catalog/mlcc_automotive_soft_en.pdf?ref_disty=mouser; Operating Temperature: -55 to +125degC; Packaging: Tape and Reel; Mounting Technology: SMT; Size: 0603; Supplier 1 Name: Mouser; Supplier 1 SN: 810-CGA3E3X8R1H104KA; Supplier 1 URL: https://www.mouser.com/ProductDetail/TDK/CGA3E3X8R1H104K080AE?qs=nQSIdc08i%252Bd8g3IRRgU2bw%3D%3D&utm_source=mouser-refine-download&utm_medium=file&utm_campaign=CGA3E3X8R1H104K080AE&utm_content=TDK; Supplier 2 Name: Digi-Key; Supplier 2 SN: 445-173697-2-ND; Supplier 2 URL: https://www.digikey.com/en/products/detail/tdk-corporation/cga3e3x8r1h104k080ae/5809262; Supplier 3 Name: thegioiic; Supplier 3 SN: N/A; Supplier 3 URL: N/A; Value: 100 nF, 50 VDC
C303 C310 C311 C314 = 0108051061025: 33 µF ±20% 6.3V Ceramic Capacitor X5R 0805 (2012 Metric); Manufacture Name: TDK; Manufacture SN: CGA4J1X7S1E106K125AE; Capacitance: 10 uF; Tolerance: +/-10%; Voltage Rating DC: 25 VDC; Operating Temperature: -55 to +125degC; Packaging: Tape and Reel; Mounting Technology: SMT; Size: 0805; Supplier 1 Name: Mouser; Supplier 1 SN: 810-CGA4J1X7S1E106K2; Supplier 1 URL: https://www.mouser.vn/ProductDetail/TDK/CGA4J1X7S1E106K125AE?qs=PqoDHHvF64%252BJvhmUzM2odA%3D%3D&utm_source=mouser-refine-download&utm_medium=file&utm_campaign=CGA4J1X7S1E106K125AE&utm_content=TDK; Supplier 2 Name: Digi-Key; Supplier 2 SN: 445-181411-2-ND; Supplier 2 URL: https://www.digikey.com/en/products/detail/tdk-corporation/cga4j1x7s1e106k125ae/9744777; Supplier 3 Name: thegioiic; Supplier 3 SN: OEM; Supplier 3 URL: N/A; Value: 33 uF, 6.3 VDC; ComponentLink3Description: Buy; ComponentLink3URL: https://www.digikey.com/en/products/detail/tdk-corporation/C2012X5R0J336M125AC/2443464
C305 C307 = 0106032241050: CAP, size 0603, 220 nF, 50 VDC; Manufacture Name: TDK; Manufacture SN: CGA3E3X7R1H224K080AE; Capacitance: 220 nF; Tolerance: +/-10%; Voltage Rating DC: 50 VDC; ComponentLink2Description: Datasheet; ComponentLink2URL: https://product.tdk.com/system/files/dam/doc/product/capacitor/ceramic/mlcc/catalog/mlcc_automotive_soft_en.pdf?ref_disty=mouser; Operating Temperature: -55 to +125degC; Packaging: Tape and Reel; Mounting Technology: SMT; Size: 0603; Supplier 1 Name: Mouser; Supplier 1 SN: 810-CGA3E3X7R1H224KA; Supplier 1 URL: https://www.mouser.com/ProductDetail/TDK/CGA3E3X7R1H224K080AE?qs=nQSIdc08i%252Bd73MzLq310Yg%3D%3D&utm_source=mouser-refine-download&utm_medium=file&utm_campaign=CGA3E3X7R1H224K080AE&utm_content=TDK; Supplier 2 Name: Digi-Key; Supplier 2 SN: 445-173635-2-ND; Supplier 2 URL: https://www.digikey.com/en/products/detail/tdk-corporation/cga3e3x7r1h224k080ae/5809200; Supplier 3 Name: thegioiic; Supplier 3 SN: N/A; Supplier 3 URL: N/A; Value: 220 nF, 50 VDC
C320 = 0106034731050: CAP, size 0603, 47 nF, 50 VDC; Manufacture Name: TDK; Manufacture SN: CGA3E2X7R1H473K080AA; Capacitance: 47 nF; Tolerance: +/-10%; Voltage Rating DC: 50 VDC; ComponentLink2Description: Datasheet; ComponentLink2URL: https://product.tdk.com/system/files/dam/doc/product/capacitor/ceramic/mlcc/catalog/mlcc_automotive_general_en.pdf?ref_disty=mouser; Operating Temperature: -55 to +125degC; Packaging: Tape and Reel; Mounting Technology: SMT; Size: 0603; Supplier 1 Name: Mouser; Supplier 1 SN: 810-CGA3E2X7R1H473K; Supplier 1 URL: https://www.mouser.com/ProductDetail/TDK/CGA3E2X7R1H473K080AA?qs=NRhsANhppD%252BXNlr9LoLgTw%3D%3D&utm_source=mouser-refine-download&utm_medium=file&utm_campaign=CGA3E2X7R1H473K080AA&utm_content=TDK; Supplier 2 Name: Digi-Key; Supplier 2 SN: 445-5664-2-ND; Supplier 2 URL: https://www.digikey.com/en/products/detail/tdk-corporation/cga3e2x7r1h473k080aa/2443142; Supplier 3 Name: thegioiic; Supplier 3 SN: N/A; Supplier 3 URL: N/A; Value: 47 nF, 50 VDC
R300 R304 R316 R329 = Resistor 4.87 MOhm 0402 1%: 4.87 MOhms ±1% 0.063W, 1/16W Chip Resistor 0402 (1005 Metric) Moisture Resistant Thick Film; ComponentLink1Description: Buy; ComponentLink1URL: https://www.digikey.com/en/products/detail/yageo/RC0402FR-074M87L/5917698
R301 R321 = Resistor 3.16 MOhm 0402 1%: 3.16 MOhms ±1% 0.063W, 1/16W Chip Resistor 0402 (1005 Metric) Automotive AEC-Q200 Thick Film; ComponentLink1Description: Buy; ComponentLink1URL: https://www.digikey.com/en/products/detail/vishay-dale/CRCW04023M16FKED/1178404
R302 R319 = Resistor 48.7 KOhm 0402 1%: 48.7 kOhms ±1% 0.063W, 1/16W Chip Resistor 0402 (1005 Metric) Automotive AEC-Q200, Moisture Resistant Thick Film; ComponentLink1Description: Buy; ComponentLink1URL: https://www.digikey.com/en/products/detail/yageo/AC0402FR-0748K7L/5895382
R303 R306 R307 R313 = Resistor 0 Ohm 0402: 0 Ohms Jumper Chip Resistor 0402 (1005 Metric) Moisture Resistant Thick Film; ComponentLink1Description: Buy; ComponentLink1URL: https://www.digikey.com/en/products/detail/yageo/RC0402JR-070RL/726406
R308 = Resistor 4.22 KOhm 0402 1%: 4.22 kOhms ±1% 0.1W, 1/10W Chip Resistor 0402 (1005 Metric) Automotive AEC-Q200 Thick Film; ComponentLink1Description: Buy; ComponentLink1URL: https://www.digikey.com/en/products/detail/panasonic-electronic-components/ERJ-2RKF4221X/192338
R309 = Resistor 60.4 KOhm 0402 1%: 60.4 kOhms ±1% 0.063W, 1/16W Chip Resistor 0402 (1005 Metric) Moisture Resistant Thick Film; ComponentLink1Description: Buy; ComponentLink1URL: https://www.digikey.com/en/products/detail/yageo/RC0402FR-0760K4L/726643
R311 = Resistor 138 KOhm 0402 1%: 138 kOhms ±1% 0.1W, 1/10W Chip Resistor 0402 (1005 Metric) Automotive AEC-Q200, Moisture Resistant Thin Film; ComponentLink1Description: Buy; ComponentLink1URL: https://www.digikey.com/en/products/detail/koa-speer-electronics-inc/RN73R1ETTP1383F25/10000727
R312 R323 R327 R328 = Resistor 14.5 KOhm 0402 0.5%: 14.5 kOhms ±0.5% 0.063W, 1/16W Chip Resistor 0402 (1005 Metric) Thin Film; ComponentLink1Description: Buy; ComponentLink1URL: https://www.digikey.com/en/products/detail/yageo/RT0402DRD0714K5L/7708273
R314 R320 = Resistor 2.87 MOhm 0402 1%: 2.87 MOhms ±1% 0.063W, 1/16W Chip Resistor 0402 (1005 Metric) Automotive AEC-Q200 Thick Film; ComponentLink1Description: Buy; ComponentLink1URL: https://www.digikey.com/en/products/detail/vishay-dale/CRCW04022M87FKED/1178399
R315 R318 = Resistor 255 Ohm 0402 1%: 255 Ohms ±1% 0.1W, 1/10W Chip Resistor 0402 (1005 Metric) Automotive AEC-Q200 Thick Film; ComponentLink1Description: Buy; ComponentLink1URL: https://www.digikey.com/en/products/detail/panasonic-electronic-components/ERJ-2RKF2550X/192252
R317 = Resistor 54.9 KOhm 0402 1%: 138 kOhms ±1% 0.1W, 1/10W Chip Resistor 0402 (1005 Metric) Automotive AEC-Q200, Moisture Resistant Thin Film; ComponentLink1Description: Buy; ComponentLink1URL: https://www.digikey.com/en/products/detail/yageo/RC0402FR-1354K9L/17024812
R322 R325 R326 R330 R333 = Resistor 10 KOhm 0402 1%: Code 103, 1/16W 1%; ComponentLink1Description: Buy; ComponentLink1URL: https://www.thegioiic.com/dien-tro-10-kohm-0402-1-
R324 = Resistor 100 KOhm 0402 1%: Code 104, 1/16W 1%; ComponentLink1Description: Buy; ComponentLink1URL: https://www.thegioiic.com/dien-tro-100-kohm-0402-1-
R331 = Resistor 1 MOhm 0402 1%_1: Code 105, 1/16W 1%; ComponentLink1Description: Buy; ComponentLink1URL: https://www.thegioiic.com/dien-tro-1-mohm-0402-1-
TP300-TP306 = Testpoint_TH: Test Point TEST-1BK; Supply Name: BanLinhKien; Datasheet: *; Supply Part Number: Test Point TEST-1BK; Supply URL: https://banlinhkien.com/test-point-test1bk-mau-den-5c-p18255999.html
U300 U302 U303 U310 = OPA2735AIDR: 0.05μV/°C max, Single-Supply CMOS Operational Amplifiers Zero-drift Series; ComponentLink1Description: Buy; ComponentLink1URL: https://www.digikey.com/en/products/detail/texas-instruments/OPA2735AIDR/1572381; Value: OPA2735AIDR
U301 = INA128UA/2K5: Precision, Low Power Instrumentation Amplifiers; ComponentLink1Description: Buy; ComponentLink1URL: https://www.digikey.com/en/products/detail/texas-instruments/INA128UA-2K5/300998; ComponentLink2Description: Datasheet; ComponentLink2URL: https://www.ti.com/lit/ds/symlink/ina129-ep.pdf?ts=1697381225295&ref_url=https%253A%252F%252Fwww.google.com%252F; Value: INA128UA/2K5
U304 = OPA735AIDBVR: Zero-Drift Amplifier 1 Circuit Rail-to-Rail SOT-23-5; Mfr_Name: Texas Instruments; RefDes: RefDes; Type: Type; ComponentLink1Description: Buy; ComponentLink1URL: https://www.digikey.com/en/products/detail/texas-instruments/OPA735AIDBVR/1572946; Value: OPA735AIDBVR
VR300 = 3296W-104: 100 KOhms 0.5W, PC Pins Through Hole Trimmer Potentiometer Cermet 25.0 Turn Top Adjustment; MF: Bourns; MP: 3296W-1-250; Purchase-URL: https://pricing.snapeda.com/search/part/3296W-1-250/?ref=eda; Check_prices: https://www.snapeda.com/parts/3296W-1-250/Bourns/view-part/?ref=eda; SnapEDA_Link: https://www.snapeda.com/parts/3296W-1-250/Bourns/view-part/?ref=snap; Price: None; Availability: In Stock; Package: NON STANDARD-3 Bourns; Buy: https://thegioiic.com/3296w-104-bien-tro-100-kohm-3-chan-chinh-top-0-5w
VR301 = 3296W-102: 1 KOhms 0.5W, PC Pins Through Hole Trimmer Potentiometer Cermet 25.0 Turn Top Adjustment; Buy: https://thegioiic.com/3296w-102-bien-tro-1-kohm-3-chan-chinh-top-0-5w

## Sheet ADC.SchDoc: EEG Measurement Circuit
size A2; Date: 24/01/2025; DrawnBy: Giang Phan Truong; SheetNumber: 5; SheetTotal: 7
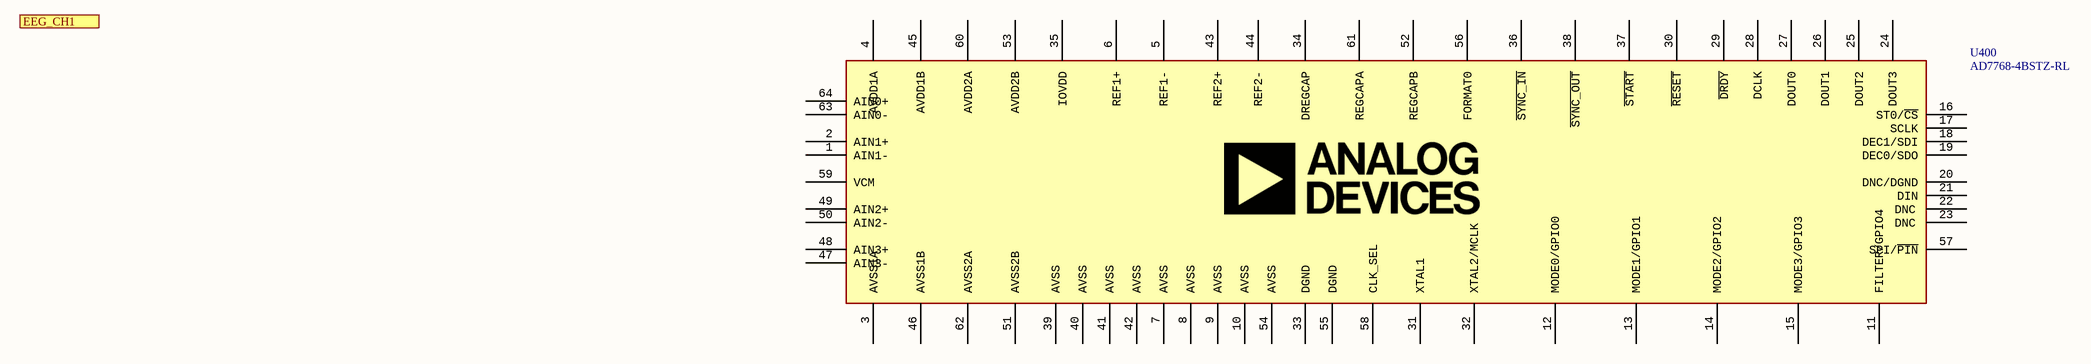
[diagram p4: ADC.SchDoc]

### Parts
U400  value AD7768-4BSTZ-RL  [ST-64-2_ADI]  (hidden comment: 24 Bit Analog to Digital Converter 4 Input 4 Sigma-Delta)

### Ports
EEG_CH1 (out, see Block Diagram[4B], EEG Preprocessing[8B])

### Nets

Not connected (* = marked no-connect by the designer): U400 1(AIN1-) 2(AIN1+) 3(AVSS1A) 4(AVDD1A) 5(REF1-) 6(REF1+) 7(AVSS) 8(AVSS) 9(AVSS) 10(AVSS) 11(FILTER/GPIO4) 12(MODE0/GPIO0) 13(MODE1/GPIO1) 14(MODE2/GPIO2) 15(MODE3/GPIO3) 16(ST0/~{CS}) 17(SCLK) 18(DEC1/SDI) 19(DEC0/SDO) 20(DNC/DGND) 21(DIN) 22(DNC) 23(DNC) 24(DOUT3) 25(DOUT2) 26(DOUT1) 27(DOUT0) 28(DCLK) 29(~{DRDY}) 30(~{RESET}) 31(XTAL1) 32(XTAL2/MCLK) 33(DGND) 34(DREGCAP) 35(IOVDD) 36(~{SYNC_IN}) 37(~{START}) 38(~{SYNC_OUT}) 39(AVSS) 40(AVSS) 41(AVSS) 42(AVSS) 43(REF2+) 44(REF2-) 45(AVDD1B) 46(AVSS1B) 47(AIN3-) 48(AIN3+) 49(AIN2+) 50(AIN2-) 51(AVSS2B) 52(REGCAPB) 53(AVDD2B) 54(AVSS) 55(DGND) 56(FORMAT0) 57(SPI/~{PIN}) 58(CLK_SEL) 59(VCM) 60(AVDD2A) 61(REGCAPA) 62(AVSS2A) 63(AIN0-) 64(AIN0+)

### Notes on the sheet
- Project Name:
- Date:
- Size
- Size:
- A2
- Last Modified:
- Revision:
- Drawn By:
- File:
- Checked By:
- Sheet
- of

### Library data of the parts
U400 = AD7768-4BSTZ-RL: 24 Bit Analog to Digital Converter 4 Input 4 Sigma-Delta 64-LQFP (10x10); Mfr_Name: Analog Devices Inc; Type: Data Acquisition; RefDes: RefDes; ComponentLink1Description: Buy; ComponentLink1URL: https://www.digikey.com/en/products/detail/analog-devices-inc/AD7768-4BSTZ-RL/6056981

## Sheet Interface.SchDoc: EEG Measurement Circuit
size A3; Date: 24/01/2025; DrawnBy: Giang Phan Truong; SheetNumber: 7; SheetTotal: 7
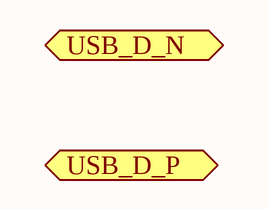
[diagram p5: Interface.SchDoc]

### Ports
USB_D_N (bidir, see Block Diagram[7B], Power Supplies[2A]), USB_D_P (bidir, see Block Diagram[7B], Power Supplies[2A])

### Notes on the sheet
- Project Name:
- Size
- Size:
- A3
- Revision:
- Drawn By:
- Date:
- File:
- Last Modified:
- Checked By:
- Sheet
- of

## Sheet Patient Protection.SchDoc: EEG Measurement Circuit
size A3; Date: 24/01/2025; DrawnBy: Giang Phan Truong; SheetNumber: 3; SheetTotal: 7
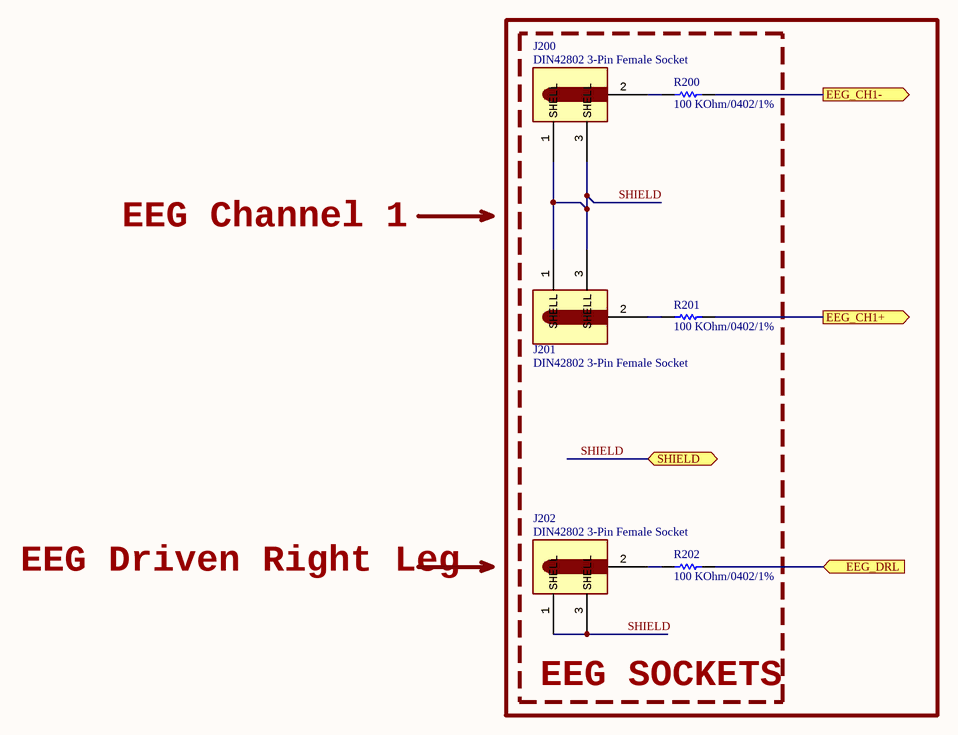
[diagram p6: Patient Protection.SchDoc]

### Parts
J200  value DIN42802 3-Pin Female Socket  [DIN42802-1.5MM SOCKET]  (hidden comment: DIN42802 1.5mm)
J201  value DIN42802 3-Pin Female Socket  [DIN42802-1.5MM SOCKET]  (hidden comment: DIN42802 1.5mm)
J202  value DIN42802 3-Pin Female Socket  [DIN42802-1.5MM SOCKET]  (hidden comment: DIN42802 1.5mm)
R200  value 100 KOhm/0402/1%  [R0402]  (hidden comment: Resistor 100 KOhm 0402 1%)
R201  value 100 KOhm/0402/1%  [R0402]  (hidden comment: Resistor 100 KOhm 0402 1%)
R202  value 100 KOhm/0402/1%  [R0402]  (hidden comment: Resistor 100 KOhm 0402 1%)

### Blocks framed on the sheet
EEG SOCKETS: J200-J202 R200-R202

### Ports
EEG_CH1+ (out, see Block Diagram[3B], EEG Preprocessing[1B]), EEG_CH1- (out, see Block Diagram[3B], EEG Preprocessing[1B]), EEG_DRL (in, see Block Diagram[3B], EEG Preprocessing[1D]), SHIELD (bidir, see Block Diagram[3B], EEG Preprocessing[2D])

### Nets
SHIELD: J200.1(SHELL) J200.3(SHELL) J201.1(SHELL) J201.3(SHELL) J202.1(SHELL) J202.3(SHELL) ; port SHIELD
NetC320_1: R202.2 ; port EEG_DRL
NetJ200_2: J200.2(PORT) R200.1
NetJ201_2: J201.2(PORT) R201.1
NetJ202_2: J202.2(PORT) R202.1
NetR200_2: R200.2 ; port EEG_CH1-
NetR201_2: R201.2 ; port EEG_CH1+

### Notes on the sheet
- EEG Channel 1
- EEG Driven Right Leg
- Project Name:
- Size
- Size:
- A3
- Revision:
- Drawn By:
- Date:
- File:
- Last Modified:
- Checked By:
- Sheet
- of

### Library data of the parts
J200-J202 = DIN42802 1.5mm: 3 PIN Socket Female Socket for PCB EEG EMG DIN42802 1.5 mm Connector; ComponentLink1Description: Buy; ComponentLink1URL: https://www.alibaba.com/product-detail/3-PIN-Socket-Female-Socket-for_62497934533.html?chatToken=TDFKeWNGRlpkWFZTWmtkNFRYRnZjVWxhVTBsU2RVcHNkRVpKVTJsMlRteERiM0ZyWlhrM2VHMXhZeTkwTVVSb2RIQnFRMGxKTmtONE9GSllWWFFyVGtka2JsY3ZLMjB6UVdnMmRsaGxWbVZpU2xFNU5HeHRNWHBhVjJNdmFXcHlSelp0VHpKc01sVnFjMGRSYUZSbkwwRm9SM0ZJYjNSd1UxVTFORmszTUhKcGRERnVaVnBHVjJsaVQwdFRTRGx6WnpCcFVURnhXbWRsZHl0UU56bE5NRkJsVjBnelNXRjZibkJGUFE9PSZ2ZXJzaW9uPTIuMC4w&encryptTargetLoginId=8pctgRBMALPo2t4oyiyajgkFqFUijPBH6wdkfYSa%2Bs4%3D
R200-R202 = Resistor 100 KOhm 0402 1%: Code 104, 1/16W 1%; ComponentLink1Description: Buy; ComponentLink1URL: https://www.thegioiic.com/dien-tro-100-kohm-0402-1-

## Nets that join several sheets
+2.5_A: Power Supplies (C114.2 C115.2 FB100.2), EEG Preprocessing (12 pins)
-2.5_A: Power Supplies (C123.2 C124.2 FB101.2), EEG Preprocessing (12 pins)
GND: Power Supplies (38 pins), EEG Preprocessing (24 pins)
NetC320_1: EEG Preprocessing (C320.1 R331.1 TP305.1 U310.7), Patient Protection (R202.2)
NetR200_2: EEG Preprocessing (R316.2 R319.2 U301.2), Patient Protection (R200.2)
NetR201_2: EEG Preprocessing (R302.1 R304.2 U301.3), Patient Protection (R201.2)
SHIELD: EEG Preprocessing (R333.2 TP304.1 U310.1 U310.2), Patient Protection (6 pins)